# EAGLE design whypod (EAGLE 7.7.0)
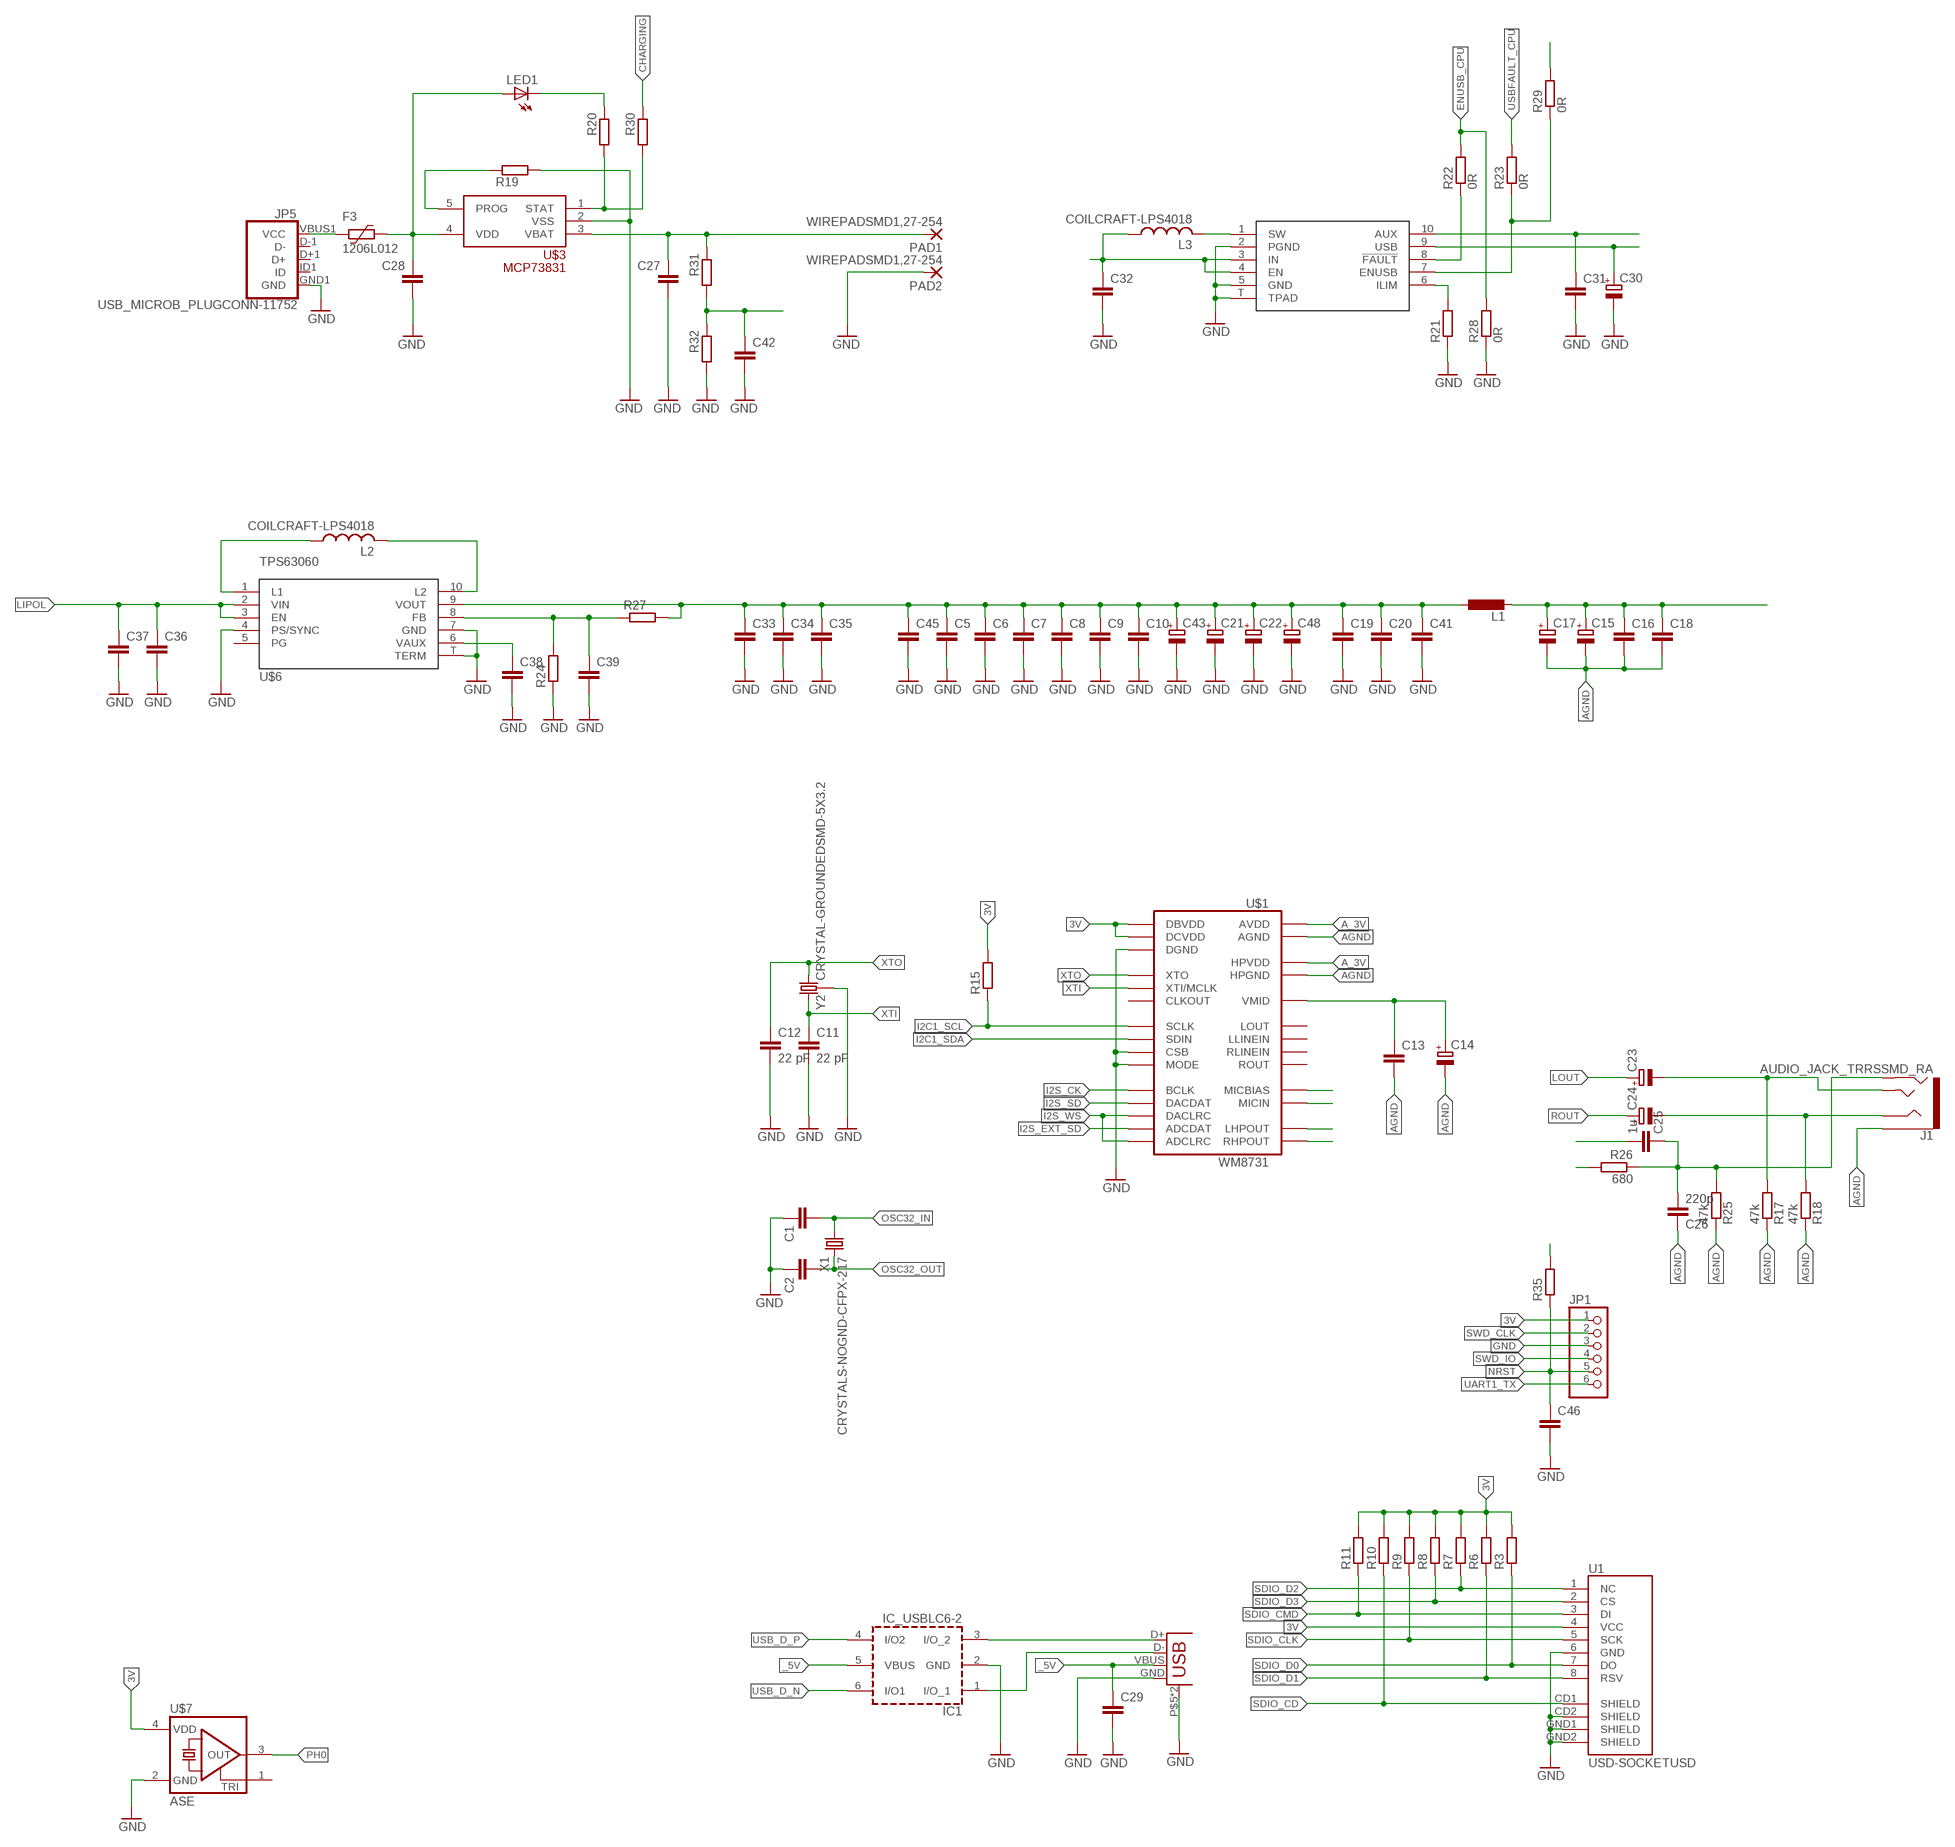
[diagram p0: schematic, sheet 1, part 1 of 2]
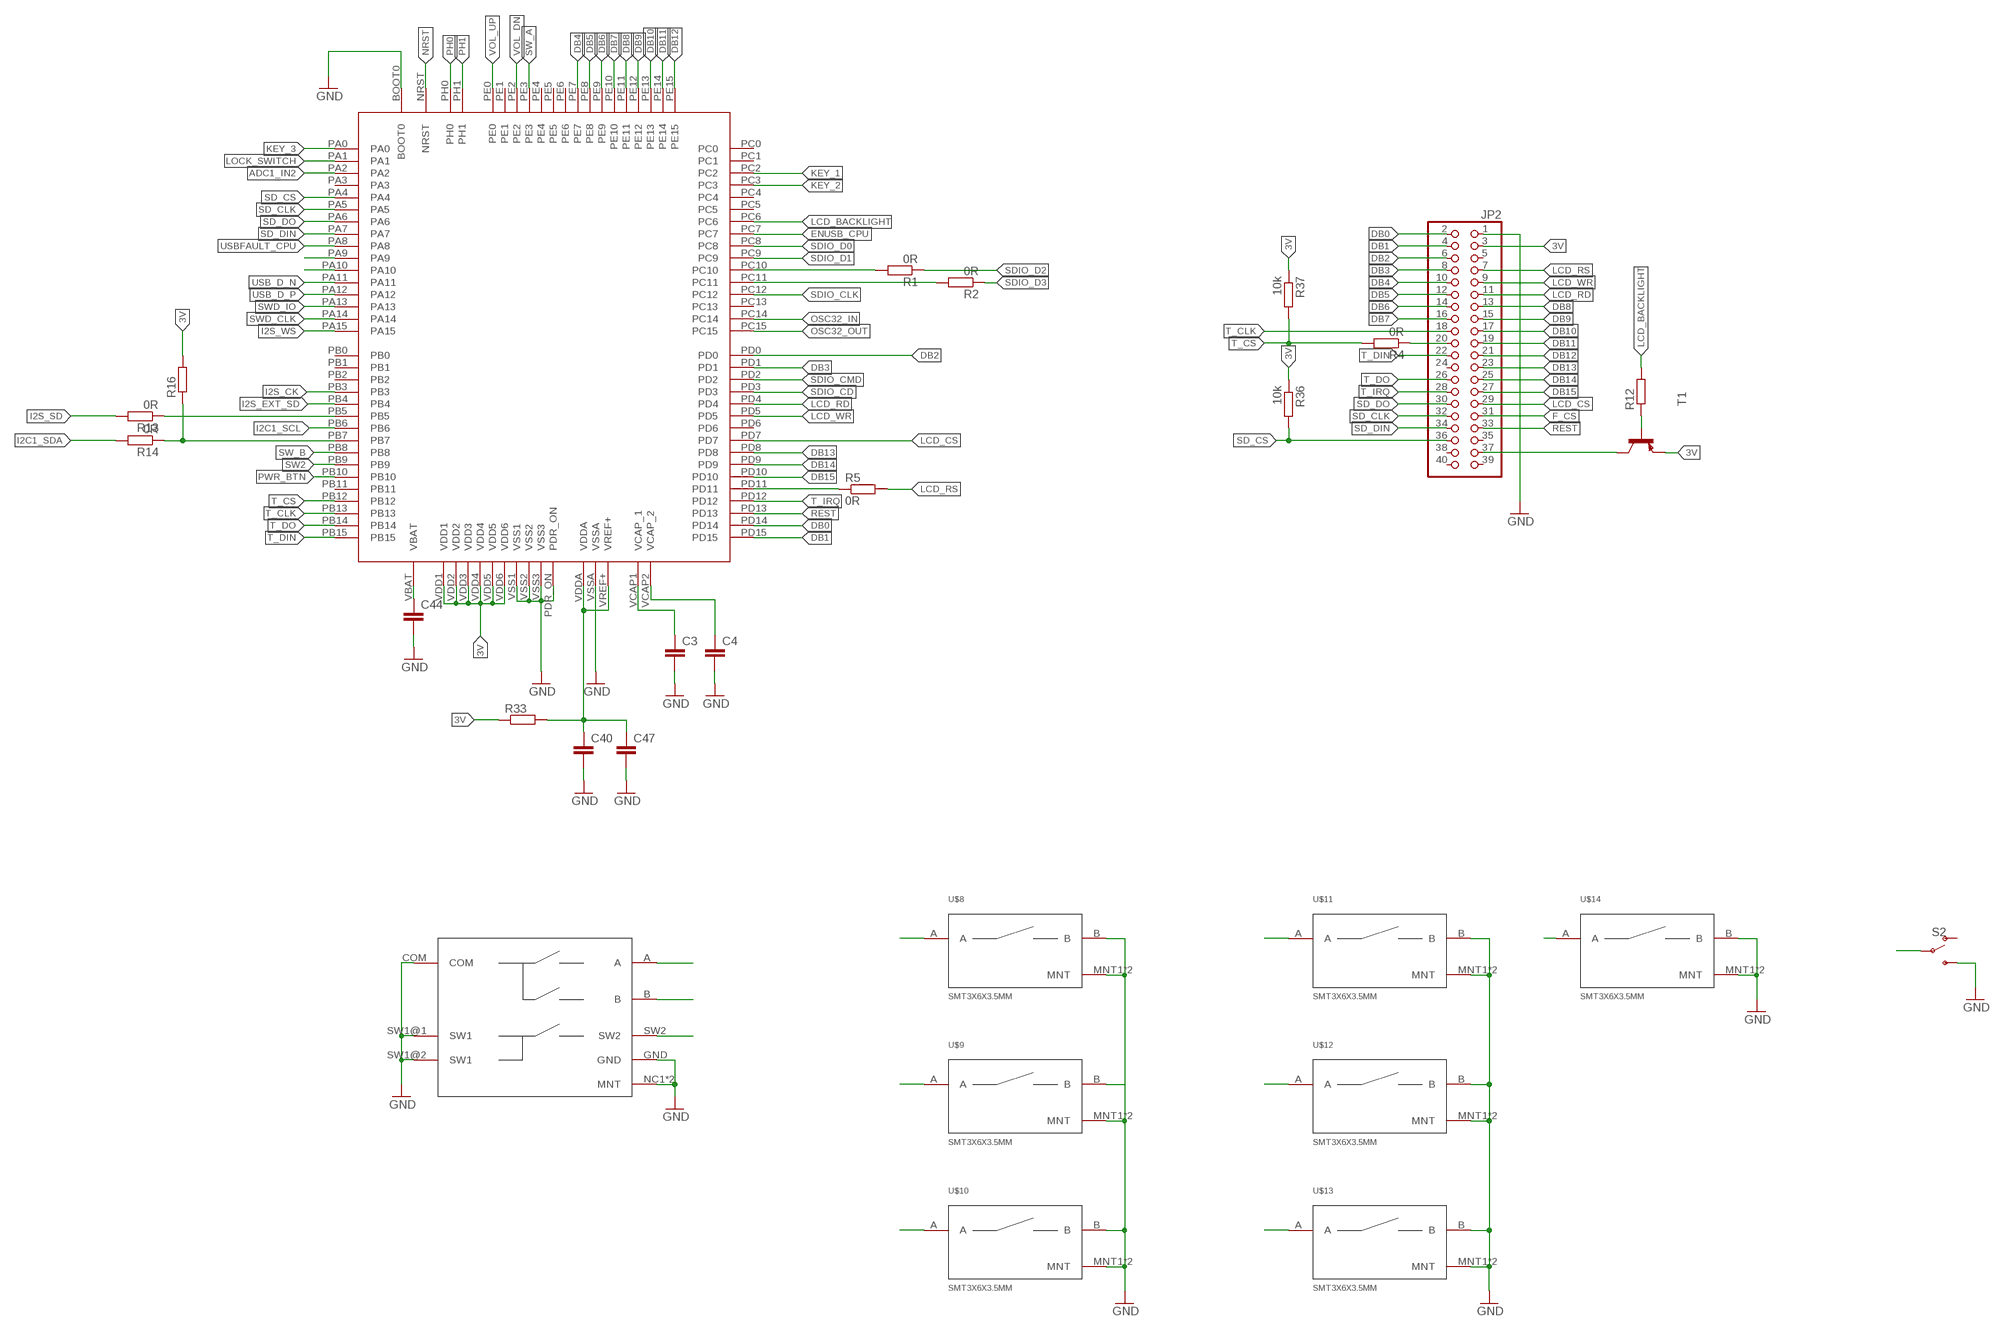
[diagram p1: schematic, sheet 1, part 2 of 2]

## Parts
C1  C-EUC0603  [C0603]
C2  C-EUC0603  [C0603]
C3  C-EUC0603  [C0603]
C4  C-EUC0603  [C0603]
C5  C-EUC0603  [C0603]
C6  C-EUC0603  [C0603]
C7  C-EUC0402  [C0402]
C8  C-EUC0603  [C0603]
C9  C-EUC0603  [C0603]
C10  C-EUC0603  [C0603]
C11  22 pF  C-EUC0603  [C0603]
C12  22 pF  C-EUC0603  [C0603]
C13  C-EUC0603  [C0603]
C14  CPOL-EUSMCA  [SMC_A]
C15  CPOL-EUSMCA  [SMC_A]
C16  C-EUC0603  [C0603]
C17  CPOL-EUSMCA  [SMC_A]
C18  C-EUC0603  [C0603]
C19  C-EUC0603  [C0603]
C20  C-EUC0603  [C0603]
C21  CPOL-EUSMCA  [SMC_A]
C22  CPOL-EUSMCA  [SMC_A]
C23  CPOL-EUSMCE  [SMC_E]
C24  CPOL-EUSMCE  [SMC_E]
C25  1u  C-EUC0603  [C0603]
C26  220p  C-EUC0603  [C0603]
C27  C-EUC0603  [C0603]
C28  C-EUC0603  [C0603]
C29  C-EUC0603  [C0603]
C30  CPOL-EUSMCD  [SMC_D]
C31  C-EUC0603  [C0603]
C32  C-EUC0603  [C0603]
C33  C-EUC0805  [C0805]
C34  C-EUC0805  [C0805]
C35  C-EUC0805  [C0805]
C36  C-EUC0805  [C0805]
C37  C-EUC0805  [C0805]
C38  C-EUC0603  [C0603]
C39  C-EUC0402  [C0402]
C40  C-EUC0402  [C0402]
C41  C-EUC0402  [C0402]
C42  C-EUC0603  [C0603]
C43  CPOL-EUSMCA  [SMC_A]
C44  C-EUC0402  [C0402]
C45  C-EUC0402  [C0402]
C46  C-EUC0603  [C0603]
C47  C-EUC0603  [C0603]
C48  CPOL-EUSMCA  [SMC_A]
F3  1206L012  [1206L]
IC1  IC_USBLC6-2  [SOT-23-6L]
J1  AUDIO_JACK_TRRSSMD_RA  [AUDIO_JACK_3.5MM_TRRS_SMD_RA]
JP1  PINHD-1X06_2.54-SMD-90°  [1X06SMD/90]
JP2  PINHD-2X20_2.54-SMD  [2X20SMD]
JP5  USB_MICROB_PLUGCONN-11752  [USB-B-MICRO-SMD_V03]
L1  L-EUL3225M  [L3225M]
L2  COILCRAFT-LPS4018  [LPS4018]
L3  COILCRAFT-LPS4018  [LPS4018]
LED1  LEDCHIP-LED0603  [CHIP-LED0603]
PAD1  WIREPADSMD1,27-254  [SMD1,27-2,54]
PAD2  WIREPADSMD1,27-254  [SMD1,27-2,54]
R1  0R  R-EU_R0603  [R0603]
R2  0R  R-EU_R0603  [R0603]
R3  R-EU_R0603  [R0603]
R4  0R  R-EU_R0603  [R0603]
R5  0R  R-EU_R0603  [R0603]
R6  R-EU_R0603  [R0603]
R7  R-EU_R0402  [R0402]
R8  R-EU_R0603  [R0603]
R9  R-EU_R0402  [R0402]
R10  R-EU_R0603  [R0603]
R11  R-EU_R0603  [R0603]
R12  R-EU_R0402  [R0402]
R13  0R  R-EU_R0603  [R0603]
R14  0R  R-EU_R0603  [R0603]
R15  R-EU_R0603  [R0603]
R16  R-EU_R0402  [R0402]
R17  47k  R-EU_R0603  [R0603]
R18  47k  R-EU_R0603  [R0603]
R19  R-EU_R0603  [R0603]
R20  R-EU_R0603  [R0603]
R21  R-EU_R0603  [R0603]
R22  0R  R-EU_R0603  [R0603]
R23  0R  R-EU_R0603  [R0603]
R24  R-EU_R0402  [R0402]
R25  47k  R-EU_R0603  [R0603]
R26  680  R-EU_R0603  [R0603]
R27  R-EU_R0402  [R0402]
R28  0R  R-EU_R0603  [R0603]
R29  0R  R-EU_R0603  [R0603]
R30  R-EU_R0603  [R0603]
R31  R-EU_R0603  [R0603]
R32  R-EU_R0603  [R0603]
R33  R-EU_M0805  [M0805]
R35  R-EU_R0603  [R0603]
R36  10k  R-EU_R0603  [R0603]
R37  10k  R-EU_R0603  [R0603]
S2  SWITCH-SPDT-SMD-RIGHT-ANGLE  [SWITCH_SPST_SMD_A]
T1  BC857A-PNP-SOT23-BEC  [SOT23-BEC]
U1  USD-SOCKETUSD  [USD-SOCKET-PP]
U$1  WM8731  [28-SSOP]
U$2  STM32F4V_100PIN_GENERIC  [LQFP100]
U$3  MCP73831SOT-23-5  [SOT-23-5]
U$4  EVQWKSMD  [EVQWK_SMD]
U$5  TPS2500  [DRC10]
U$6  TPS63060  [DRC10]
U$7  ASE  [ASE]
U$8  SMT3X6X3.5MM  [SMT3X6X3.5MM]
U$9  SMT3X6X3.5MM  [SMT3X6X3.5MM]
U$10  SMT3X6X3.5MM  [SMT3X6X3.5MM]
U$11  SMT3X6X3.5MM  [SMT3X6X3.5MM]
U$12  SMT3X6X3.5MM  [SMT3X6X3.5MM]
U$13  SMT3X6X3.5MM  [SMT3X6X3.5MM]
U$14  SMT3X6X3.5MM  [SMT3X6X3.5MM]
X1  CRYSTALS-NOGND-CFPX-217  [3.2X1.5-2-PAD]
X2  USB-A-S  [USB-A-S]
Y2  CRYSTAL-GROUNDEDSMD-5X3.2  [CRYSTAL-SMD-5X3.2-4PAD]

## Nets
3V: C5.1 C6.1 C7.1 C8.1 C9.1 C10.1 C19.1 C20.1 C21.+ C22.+ C33.1 C34.1 C35.1 C41.1 C43.+ C45.1 C48.+ JP1.1 JP2.3 L1.1 R3.2 R6.2 R7.2 R8.2 R9.2 R10.2 R11.2 R15.2 R16.2 R27.2 R29.2 R33.1 R35.2 R36.1 R37.1 T1.E U1.4(VCC) U$1.P$1(DBVDD) U$1.P$27(DCVDD) U$2.VDD1 U$2.VDD2 U$2.VDD3 U$2.VDD4 U$2.VDD5 U$2.VDD6 U$6.9(VOUT) U$7.4(VDD)
_5V: C29.1 C30.+ IC1.5(VBUS) U$5.9(USB) X2.VBUS
A_3V: C15.+ C16.1 C17.+ C18.1 L1.2 U$1.P$8(HPVDD) U$1.P$14(AVDD)
ADC1_IN2: C42.1 R31.2 R32.1 U$2.PA2
AGND: C13.2 C14.- C15.- C16.2 C17.- C18.2 C26.1 J1.EARTH R17.1 R18.1 R25.1 U$1.P$11(HPGND) U$1.P$15(AGND)
CHARGING: R30.1 U$2.PA10
DB0: JP2.2 U$2.PD14
DB1: JP2.4 U$2.PD15
DB2: JP2.6 U$2.PD0
DB3: JP2.8 U$2.PD1
DB4: JP2.10 U$2.PE7
DB5: JP2.12 U$2.PE8
DB6: JP2.14 U$2.PE9
DB7: JP2.16 U$2.PE10
DB8: JP2.13 U$2.PE11
DB9: JP2.15 U$2.PE12
DB10: JP2.17 U$2.PE13
DB11: JP2.19 U$2.PE14
DB12: JP2.21 U$2.PE15
DB13: JP2.23 U$2.PD8
DB14: JP2.25 U$2.PD9
DB15: JP2.27 U$2.PD10
ENUSB: R22.1 U$5.8(!FAULT)
ENUSB_CPU: R22.2 R28.2 U$2.PC7
F_CS: JP2.31
GND: C1.1 C2.1 C3.2 C4.2 C5.2 C6.2 C7.2 C8.2 C9.2 C10.2 C11.2 C12.2 C19.2 C20.2 C21.- C22.- C27.2 C28.2 C29.2 C30.- C31.2 C32.2 C33.2 C34.2 C35.2 C36.2 C37.2 C38.2 C39.2 C40.2 C41.2 C42.2 C43.- C44.2 C45.2 C46.2 C47.2 C48.- IC1.2(GND) JP1.3 JP2.1 JP5.GND1(GND) PAD2.1(P) R19.2 R21.1 R24.1 R28.1 R32.2 S2.3(S) U1.6(GND) U1.CD2(SHIELD) U1.GND1(SHIELD) U1.GND2(SHIELD) U$1.P$21(MODE) U$1.P$22(CSB) U$1.P$28(DGND) U$2.BOOT0 U$2.PDR_ON U$2.VSS1 U$2.VSS2 U$2.VSS3 U$2.VSSA U$3.2(VSS) U$4.COM U$4.GND U$4.NC1(MNT) U$4.NC2(MNT) U$4.SW1@1(SW1) U$4.SW1@2(SW1) U$5.2(PGND) U$5.5(GND) U$5.T(TPAD) U$6.4(PS/SYNC) U$6.7(GND) U$6.T(TERM) U$7.2(GND) U$8.B U$8.MNT1(MNT) U$8.MNT2(MNT) U$9.B U$9.MNT1(MNT) U$9.MNT2(MNT) U$10.B U$10.MNT1(MNT) U$10.MNT2(MNT) U$11.B U$11.MNT1(MNT) U$11.MNT2(MNT) U$12.B U$12.MNT1(MNT) U$12.MNT2(MNT) U$13.B U$13.MNT1(MNT) U$13.MNT2(MNT) U$14.B U$14.MNT1(MNT) U$14.MNT2(MNT) X2.GND X2.P$5(SHIELD) X2.P$6(SHIELD) Y2.2 Y2.4
I2C1_SCL: R15.1 U$1.P$24(SCLK) U$2.PB6
I2C1_SDA: R14.2 U$1.P$23(SDIN)
I2S_CK: U$1.P$3(BCLK) U$2.PB3
I2S_EXT_SD: U$1.P$6(ADCDAT) U$2.PB4
I2S_SD: R13.2 U$1.P$4(DACDAT)
I2S_WS: U$1.P$5(DACLRC) U$1.P$7(ADCLRC) U$2.PA15
KEY_1: U$2.PC2 U$11.A
KEY_2: U$2.PC3 U$12.A
KEY_3: U$2.PA0 U$13.A
LCD_BACKLIGHT: R12.2 U$2.PC6
LCD_CS: JP2.29 U$2.PD7
LCD_RD: JP2.11 U$2.PD4
LCD_RS: JP2.7 R5.2
LCD_WR: JP2.9 U$2.PD5
LED_A: JP2.37 T1.C
LIPOL: C27.1 C32.1 C36.1 C37.1 L3.1 PAD1.1(P) R31.1 U$3.3(VBAT) U$5.3(IN) U$5.4(EN) U$6.2(VIN) U$6.3(EN)
LOCK_SWITCH: S2.2(P) U$2.PA1
LOUT: C23.+ U$1.P$9(LHPOUT)
MICBIAS: R26.2 U$1.P$17(MICBIAS)
MICIN: C25.2 U$1.P$18(MICIN)
N$1: IC1.3(I/O_2) X2.D+
N$2: IC1.1(I/O_1) X2.D-
N$3: JP2.20 R4.1
N$4: R5.1 U$2.PD11
N$5: R1.2 U$2.PC10
N$6: C3.1 U$2.VCAP1(VCAP_1)
N$7: C4.1 U$2.VCAP2(VCAP_2)
N$8: R2.2 U$2.PC11
N$11: R12.1 T1.B
N$12: C13.1 C14.+ U$1.P$16(VMID)
N$13: C23.- J1.TIP R17.2
N$14: R13.1 U$2.PB5
N$15: C24.- J1.RING1 R18.2
N$16: R14.1 R16.1 U$2.PB7
N$17: R19.1 U$3.5(PROG)
N$18: R20.2 R30.2 U$3.1(STAT)
N$19: LED1.C R20.1
N$20: F3.2 JP5.VBUS1(VCC)
N$21: R21.2 U$5.6(ILIM)
N$22: C31.1 U$5.10(AUX)
N$23: C38.1 U$6.6(VAUX)
N$24: L3.2 U$5.1(SW)
N$25: C39.1 R24.2 R27.1 U$6.8(FB)
N$26: L2.2 U$6.10(L2)
N$27: L2.1 U$6.1(L1)
N$28: C40.1 C47.1 R33.2 U$2.VDDA U$2.VREF+
N$30: C44.1 U$2.VBAT
N$55: C25.1 C26.2 J1.RING2 R25.2 R26.1
NRST: C46.1 JP1.5 R35.1 U$2.NRST U$14.A
OSC32_IN: C1.2 U$2.PC14 X1.1
OSC32_OUT: C2.2 U$2.PC15 X1.2
PH0: U$2.PH0 U$7.3(OUT)
PH1: U$2.PH1
PWR_BTN: U$2.PB10 U$8.A
REST: JP2.33 U$2.PD13
ROUT: C24.+ U$1.P$10(RHPOUT)
SD_CLK: JP2.32 U$2.PA5
SD_CS: JP2.36 R36.2 U$2.PA4
SD_DIN: JP2.34 U$2.PA7
SD_DO: JP2.30 U$2.PA6
SDIO_CD: R10.1 U1.CD1(SHIELD) U$2.PD3
SDIO_CLK: R9.1 U1.5(SCK) U$2.PC12
SDIO_CMD: R11.1 U1.3(DI) U$2.PD2
SDIO_D0: R3.1 U1.7(DO) U$2.PC8
SDIO_D1: R6.1 U1.8(RSV) U$2.PC9
SDIO_D2: R1.1 R7.1 U1.1(NC)
SDIO_D3: R2.1 R8.1 U1.2(CS)
SW2: U$2.PB9 U$4.SW2
SW_A: U$2.PE3 U$4.A
SW_B: U$2.PB8 U$4.B
SWD_CLK: JP1.2 U$2.PA14
SWD_IO: JP1.4 U$2.PA13
T_CLK: JP2.18 U$2.PB13
T_CS: R4.2 R37.2 U$2.PB12
T_DIN: JP2.22 U$2.PB15
T_DO: JP2.26 U$2.PB14
T_IRQ: JP2.28 U$2.PD12
UART1_TX: JP1.6 U$2.PA9
USB_D_N: IC1.6(I/O1) U$2.PA11
USB_D_P: IC1.4(I/O2) U$2.PA12
USBFAULT: R23.1 R29.1 U$5.7(ENUSB)
USBFAULT_CPU: R23.2 U$2.PA8
VBUS: C28.1 F3.1 LED1.A U$3.4(VDD)
VOL_DN: U$2.PE2 U$10.A
VOL_UP: U$2.PE0 U$9.A
XTI: C11.1 U$1.P$25(XTI/MCLK) Y2.3
XTO: C12.1 U$1.P$26(XTO) Y2.1
Unconnected: JP2.5 JP2.24 JP2.35 JP2.38 JP2.39 JP2.40 JP5.D+1(D+) JP5.D-1(D-) JP5.ID1(ID) S2.1(O) U$1.P$2(CLKOUT) U$1.P$12(LOUT) U$1.P$13(ROUT) U$1.P$19(RLINEIN) U$1.P$20(LLINEIN) U$2.PA3 U$2.PB0 U$2.PB1 U$2.PB2 U$2.PB11 U$2.PC0 U$2.PC1 U$2.PC4 U$2.PC5 U$2.PC13 U$2.PD6 U$2.PE1 U$2.PE4 U$2.PE5 U$2.PE6 U$6.5(PG) U$7.1(TRI)

## Library data of the parts
C1-C13 C16 C18-C20 C25-C29 C31-C42 C44-C47 = rcl:C-EU: CAPACITOR, European symbol
C14 C15 C17 C21-C24 C30 C43 C48 = rcl:CPOL-EU: POLARIZED CAPACITOR, European symbol
F3 = polyfuse-smd_10:?: Polyfuse Resettable PTC Source: http://www.littelfuse.com/products/resettable-ptcs.aspx; MF: Littelfuse; MPN: 1206L012; OC_FARNELL: 1596988; OC_NEWARK: 05M2298
IC1 = dp_devices:IC_USBLC6-2
J1 = SparkFun-Connectors:AUDIO_JACK_TRRS: Audio Jack - 3.5mm TRRS (SMD) This is a 3.5mm TRRS SMD audio jack. TRRS connectors are the audio-style connectors that you see on some phones, MP3 players and development boards. TRRS stands for “tip, ring, ring, sleeve,” which reflects that this has three conductors and a ground. SparkFun Products: Audio Jack <https://www.sparkfun.com/products/12639> mbed Starter Kit <https://www.sparkfun.com/products/12968> SparkFun TRRS 3.5mm Jack Breakout <https://www.sparkfun.com/products/11570>; PROD_ID: CONN-10676; SF_ID: PRT-12639
JP1 = pinhead-2:PINHD-1X06: PIN HEADER
JP2 = pinhead-2:PINHD-2X20: PIN HEADER
JP5 = SparkFun-Connectors:USB_MICROB_PLUG: USB Micro-B connectors Some male, some female. Watch your step!; PROD_ID: CONN-11752
L1 = rcl:L-EU: INDUCTOR, European symbol
L2 L3 = passives:COILCRAFT-LPS4018: Coilcraft Shielded SMT Power Inductors – LPS4018 Series
LED1 = led:LED: LED OSRAM: - CHIPLED LG R971, LG N971, LY N971, LG Q971, LY Q971, LO R971, LY R971 LH N974, LH R974 LS Q976, LO Q976, LY Q976 LO Q996 - Hyper CHIPLED LW Q18S LB Q993, LB Q99A, LB R99A - SideLED LS A670, LO A670, LY A670, LG A670, LP A670 LB A673, LV A673, LT A673, LW A673 LH A674 LY A675 LS A676, LA A676, LO A676, LY A676, LW A676 LS A679, LY A679, LG A679 - Hyper Micro SIDELED® LS Y876, LA Y876, LO Y876, LY Y876 LT Y87S - SmartLED LW L88C, LW L88S LB L89C, LB L89S, LG L890 LS L89K, LO L89K, LY L89K LS L896, LA L896, LO L896, LY L896 - TOPLED LS T670, LO T670, LY T670, LG T670, LP T670 LSG T670, LSP T670, LSY T670, LOP T670, LYG T670 LG T671, LOG T671, LSG T671 LB T673, LV T673, LT T673, LW T673 LH T674 LS T676, LA T676, LO T676, LY T676, LB T676, LH T676, LSB T676, LW T676 LB T67C, LV T67C, LT T67C, LS T67K, LO T67K, LY T67K, LW E67C LS E67B, LA E67B, LO E67B, LY E67B, LB E67C, LV E67C, LT E67C LW T67C LS T679, LY T679, LG T679 LS T770, LO T770, LY T770, LG T770, LP T770 LB T773, LV T773, LT T773, LW T773 LH T774 LS E675, LA E675, LY E675, LS T675 LS T776, LA T776, LO T776, LY T776, LB T776 LHGB T686 LT T68C, LB T68C - Hyper Mini TOPLED® LB M676 - Mini TOPLED Santana® LG M470 LS M47K, LO M47K, LY M47K Source: http://www.osram.convergy.de LUXEON: - LUMILED® LXK2-PW12-R00, LXK2-PW12-S00, LXK2-PW14-U00, LXK2-PW14-V00 LXK2-PM12-R00, LXK2-PM12-S00, LXK2-PM14-U00 LXK2-PE12-Q00, LXK2-PE12-R00, LXK2-PE12-S00, LXK2-PE14-T00, LXK2-PE14-U00 LXK2-PB12-K00, LXK2-PB12-L00, LXK2-PB12-M00, LXK2-PB14-N00, LXK2-PB14-P00, LXK2-PB14-Q00 LXK2-PR12-L00, LXK2-PR12-M00, LXK2-PR14-Q00, LXK2-PR14-R00 LXK2-PD12-Q00, LXK2-PD12-R00, LXK2-PD12-S00 LXK2-PH12-R00, LXK2-PH12-S00 LXK2-PL12-P00, LXK2-PL12-Q00, LXK2-PL12-R00 Source: www.luxeon.com KINGBRIGHT: KA-3528ASYC Source: www.kingbright.com
PAD1 PAD2 = wirepad:WIREPAD: Wire PAD connect wire on PCB
R1-R33 R35-R37 = rcl:R-EU_: RESISTOR, European symbol
S2 = SparkFun-Switches:SWITCH-SPDT: Single Pole, Double Throw (SPDT) Switch Single-pole, double-throw (SPDT) switch. Variant Overview SMD-AYZ0202 Surface Mount DPDT Switch <https://www.sparkfun.com/products/597> (COM-00597) Used on e.g. LilyPad Arduino USB - ATmega32U4 Board <https://www.sparkfun.com/products/12049> PTH-11.6X4.0MM SPDT Mini Power Switch <https://www.sparkfun.com/products/102> (COM-00102) Used on e.g. SparkFun Simon Says - Through-Hole Soldering Kit <https://www.sparkfun.com/products/10547> (KIT-10547) PTH-11.6X4.0MM-KIT KIT version of SPDT Mini Power Switch - Simplifies soldering by removing tStop of switch pins - only one side can be soldered. PTH-11.6X4.0MM-LOCK LOCK version of SPDT Mini Power Switch - Offset pins hold switch in place for easier soldering. SMD-RIGHT-ANGLE Surface Mount Right Angle Switch <https://www.sparkfun.com/products/10860> (COM-10860) Used on e.g. SparkFun ESP8266 Thing <https://www.sparkfun.com/products/13231>; PROD_ID: SWCH-10651; SF_SKU: COM-10860
T1 = transistor:*-PNP-: PNP Transistror
U1 = SparkFun-Connectors:USD-SOCKET: microSD Socket Push-push type uSD socket. Schematic element and footprint production proven. Spark Fun Electronics SKU : PRT-00127. tDoc lines correctly indicate media card edge positions when inserting (unlocked, locked, depressed).
U$1 = microdecv1:WM8731
U$2 = stm32f4:STM32F4V_100PIN_GENERIC
U$3 = lion-charger:MCP73831
U$4 = mw:EVQWK
U$5 = mw:TPS2500
U$6 = mw:TPS63060
U$7 = crystal:ASE: 3.3Vdc CMOS SMD CRYSTAL CLOCK OSCILLATOR SOurce: www.abracon.com; OC_FARNELL: unknown; OC_NEWARK: unknown
U$8-U$14 = mw:SMT3X6X3.5MM
X1 = IQD-Frequency-Products:CRYSTALS-NOGND: CRYSTALS CAN NOT GROUNDED
X2 = con-usb:USB: USB Connectors
Y2 = SparkFun-Clocks:CRYSTAL-GROUNDED: Crystals w/ Ground Pin (Generic) These are passive quartz crystals, which can be used as a clock source for a microcontroller. Crystal's are usually two-terminal devices. A third terminal may be optionally connected to ground, as recommended by the manufaturer.

## Board
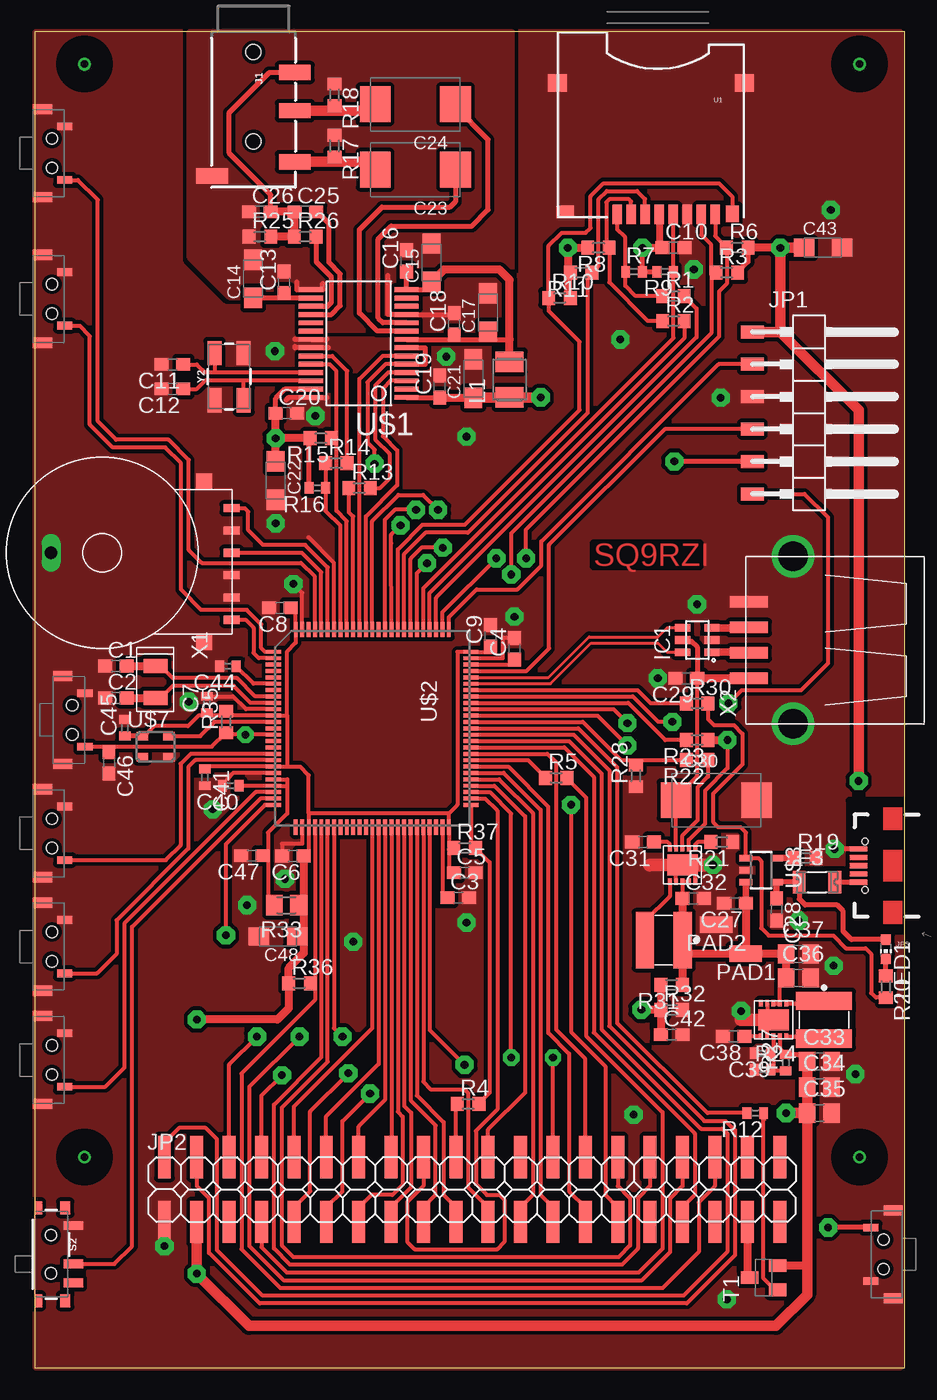
[diagram p2: board, top side]
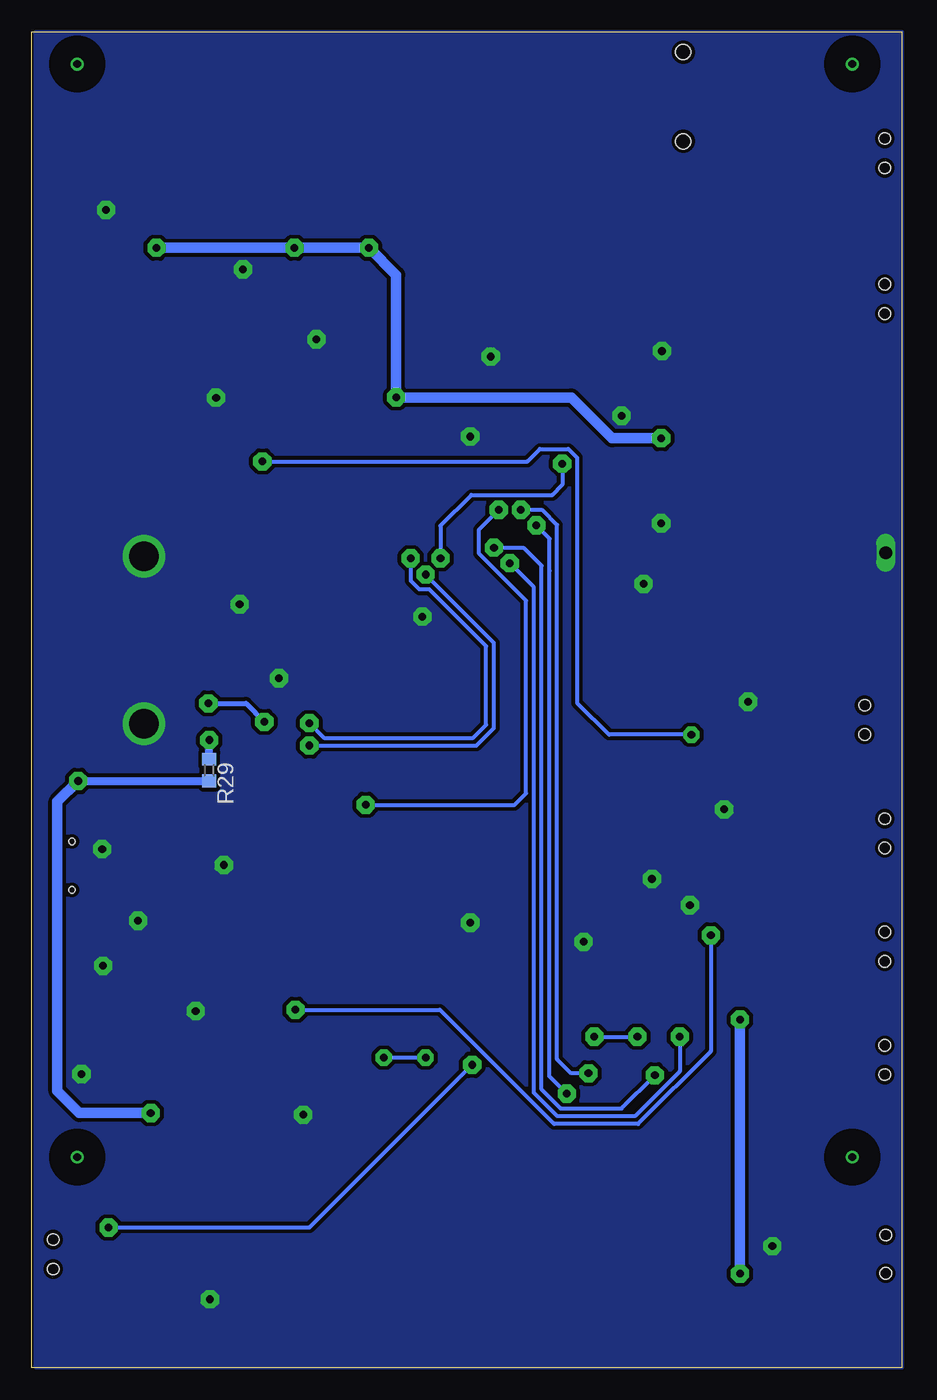
[diagram p3: board, bottom side, seen from below]

Size 68.25 x 104.77 mm. Coordinates in mm from the lower left corner, seen from the top.
Outline: 0,0 68.25,0 68.25,104.77 0,104.77 0,0
Copper layers (1*16): Top 0.035mm / dielectric 1.5mm / Bottom 0.035mm
Design rules "default *": minimum track width 10mil, minimum drill 24mil, track to track 8mil, track to pad 8mil, pad to pad 8mil, via to via 8mil, smd to smd 8mil, copper to edge 0mil, drill to drill 8mil, minimum pad ring 10mil, minimum via ring 8mil, stop-mask expansion 4mil, vias tented up to drill 0mil, thermal gap 10mil
tRestrict: area 2.1,14.7 to 5.7,18.3; area 62.9,14.7 to 66.5,18.3; area 63.9,34.3 to 67.9,44.5; area 49.7,37.8 to 51.9,41; area 60.3,36.8 to 63.6,39; area 56.8,25.7 to 59.1,28.8; area 59.7,26 to 64.1,28.6; area 48.3,31.3 to 50.3,35.7; area 62.9,100.5 to 66.5,104; area 2.1,100.5 to 5.7,104; area 22.9,57.3 to 24.1,57.8
bRestrict: area 2.1,100.5 to 5.7,104; area 62.9,100.5 to 66.5,104; area 2.1,14.7 to 5.7,18.3; area 62.9,14.7 to 66.5,18.3

### Footprints (pad centres in the part's own frame; a part is rotated, then mirrored left to right if it is on the bottom)
C0603 = smd 1.1 x 1: 1 -0.85,0; 2 0.85,0
C0402 = smd 0.7 x 0.9: 1 -0.65,0; 2 0.65,0
SMC_A = smd 1.6 x 1.4: + -1.5,0; - 1.5,0
SMC_E = smd 2.4 x 2.8: + -3.15,0; - 3.15,0
SMC_D = smd 2.4 x 2.8: + -3.15,0; - 3.15,0
C0805 = smd 1.3 x 1.5: 1 -0.95,0; 2 0.95,0
1206L = smd 1 x 1.8: 1 -1.4,0; 2 1.4,0
SOT-23-6L = smd 0.6 x 1.2: 1 -0.95,-2.3; 2 0,-2.3; 3 0.95,-2.3; 4 0.95,0; 5 0,0; 6 -0.95,0
AUDIO_JACK_3.5MM_TRRS_SMD_RA = smd 1.2 x 2.5: EARTH 11.3,-3.25; RING1 6.2,3.25; RING2 3.2,3.25; TIP 10.2,3.25 | hole 1.2: 1.6,0; 8.6,0
1X06SMD/90 = smd 1.016 x 1.778: 1 -1.27,-5.08; 2 1.27,-5.08; 3 3.81,-5.08; 4 6.35,-5.08; 5 8.89,-5.08; 6 11.43,-5.08
2X20SMD = smd 1.016 x 3.302: 1 -1.27,-3.81; 2 -1.27,1.27; 3 1.27,-3.81; 4 1.27,1.27; 5 3.81,-3.81; 6 3.81,1.27; 7 6.35,-3.81; 8 6.35,1.27; 9 8.89,-3.81; 10 8.89,1.27; 11 11.43,-3.81; 12 11.43,1.27; 13 13.97,-3.81; 14 13.97,1.27; 15 16.51,-3.81; 16 16.51,1.27; 17 19.05,-3.81; 18 19.05,1.27; 19 21.59,-3.81; 20 21.59,1.27; 21 24.13,-3.81; 22 24.13,1.27; 23 26.67,-3.81; 24 26.67,1.27; 25 29.21,-3.81; 26 29.21,1.27; 27 31.75,-3.81; 28 31.75,1.27; 29 34.29,-3.81; 30 34.29,1.27; 31 36.83,-3.81; 32 36.83,1.27; 33 39.37,-3.81; 34 39.37,1.27; 35 41.91,-3.81; 36 41.91,1.27; 37 44.45,-3.81; 38 44.45,1.27; 39 46.99,-3.81; 40 46.99,1.27
USB-B-MICRO-SMD_V03 = smd 1.4 x 0.4: D+1 2.7,0; D-1 2.7,0.65; GND1 2.7,-1.3; ID1 2.7,-0.65; VBUS1 2.7,1.3 | hole 0.5: 2.2,1.9; 2.2,-1.9
L3225M = smd 1.6 x 2.2: 1 -1.4,0; 2 1.4,0
LPS4018 = smd 1.435 x 4.394: 1 -1.48,0; 2 1.48,0
CHIP-LED0603 = smd 0.8 x 0.8: A 0,-0.75; C 0,0.75
SMD1,27-2,54 = smd 1.27 x 2.54: 1 0,0
R0603 = smd 1 x 1.1: 1 -0.85,0; 2 0.85,0
R0402 = smd 0.7 x 0.9: 1 -0.65,0; 2 0.65,0
M0805 = smd 1.3 x 1.6: 1 -0.95,0; 2 0.95,0
SWITCH_SPST_SMD_A = smd 0.7 x 1.5: 1 -2.25,-1.75; 2 -0.75,-1.75; 3 2.25,-1.75 | smd 1 x 0.6: GND1 -3.65,1; GND3 3.65,1 | smd 1 x 0.8: GND2 -3.65,-1.1; GND4 3.65,-1.1 | hole 0.9: -1.5,0; 1.5,0
SOT23-BEC = smd 1 x 1.4: B -0.95,-1.1; C 0,1.1; E 0.95,-1.1
USD-SOCKET-PP = smd 0.75 x 1.5: 1 3.2,14.3; 2 2.1,14.3; 3 1,14.3; 4 -0.1,14.3; 5 -1.2,14.3; 6 -2.3,14.3; 7 -3.4,14.3; 8 -4.5,14.3 | smd 1 x 1.3: CD1 -5.85,14.25 | smd 1.4 x 1: CD2 7.275,14.1 | smd 1.5 x 1.35: GND1 -6.775,4; GND2 7.875,4
28-SSOP = smd 0.381 x 1.905: P$1 -4.55,-3.752; P$2 -3.9,-3.752; P$3 -3.25,-3.752; P$4 -2.6,-3.752; P$5 -1.95,-3.752; P$6 -1.3,-3.752; P$7 -0.65,-3.752; P$8 0,-3.752; P$9 0.65,-3.752; P$10 1.3,-3.752; P$11 1.95,-3.752; P$12 2.6,-3.752; P$13 3.25,-3.752; P$14 3.9,-3.752; P$15 3.9,3.752; P$16 3.25,3.752; P$17 2.6,3.752; P$18 1.95,3.752; P$19 1.3,3.752; P$20 0.65,3.752; P$21 0,3.752; P$22 -0.65,3.752; P$23 -1.3,3.752; P$24 -1.95,3.752; P$25 -2.6,3.752; P$26 -3.25,3.752; P$27 -3.9,3.752; P$28 -4.55,3.752
LQFP100 = smd 1.2 x 0.3: BOOT0 -7.75,-3; PA3 7.75,-6.016; PA4 7.75,-4.5; PA5 7.75,-4; PA6 7.75,-3.5; PA7 7.75,-3; PA14 -7.75,6; PA15 -7.75,5.5; PB0 7.75,-1.5; PB1 7.75,-1; PB2 7.75,-0.5; PB3 -7.75,-0.5; PB4 -7.75,-1; PB5 -7.75,-1.5; PB6 -7.75,-2; PB7 -7.75,-2.5; PB8 -7.75,-3.5; PB9 -7.75,-4; PB10 7.75,4.5; PB11 7.75,5; PC4 7.75,-2.5; PC5 7.75,-2; PC10 -7.75,5; PC11 -7.75,4.5; PC12 -7.75,4; PD0 -7.75,3.5; PD1 -7.75,3; PD2 -7.75,2.5; PD3 -7.75,2; PD4 -7.75,1.5; PD5 -7.75,1; PD6 -7.75,0.5; PD7 -7.75,0; PDR_ON -7.75,-5.5; PE0 -7.75,-4.5; PE1 -7.75,-5; PE7 7.75,0; PE8 7.75,0.5; PE9 7.75,1; PE10 7.75,1.5; PE11 7.75,2; PE12 7.75,2.5; PE13 7.75,3; PE14 7.75,3.5; PE15 7.75,4; VCAP1 7.75,5.5; VDD3 7.75,-4.984; VDD4 7.75,6; VDD6 -7.75,-6; VSS2 7.75,-5.5 | smd 0.3 x 1.2: NRST 0.5,-7.75; PA0 5,-7.75; PA1 5.5,-7.75; PA2 6,-7.75; PA8 -2,7.75; PA9 -2.5,7.75; PA10 -3,7.75; PA11 -3.5,7.75; PA12 -4,7.75; PA13 -4.5,7.75; PB12 6,7.75; PB13 5.5,7.75; PB14 5,7.75; PB15 4.5,7.75; PC0 1,-7.75; PC1 1.5,-7.75; PC2 2,-7.75; PC3 2.5,-7.75; PC6 0,7.75; PC7 -0.5,7.75; PC8 -1,7.75; PC9 -1.5,7.75; PC13 -3,-7.75; PC14 -2.5,-7.75; PC15 -2,-7.75; PD8 4,7.75; PD9 3.5,7.75; PD10 3,7.75; PD11 2.5,7.75; PD12 2,7.75; PD13 1.5,7.75; PD14 1,7.75; PD15 0.5,7.75; PE2 -6,-7.75; PE3 -5.5,-7.75; PE4 -5,-7.75; PE5 -4.5,-7.75; PE6 -4,-7.75; PH0 -0.5,-7.75; PH1 0,-7.75; VBAT -3.5,-7.75; VCAP2 -5,7.75; VDD1 -1,-7.75; VDD2 3,-7.75; VDD5 -6,7.75; VDDA 4.5,-7.75; VREF+ 4,-7.75; VSS1 -1.5,-7.75; VSS3 -5.5,7.75; VSSA 3.5,-7.75
SOT-23-5 = smd 0.5 x 1: 1 -0.95,-1.2; 2 0,-1.2; 3 0.95,-1.2; 4 0.95,1.2; 5 -0.95,1.2
EVQWK_SMD = smd 1.27 x 0.635: A 10.16,-5.25; B 10.16,3.5; COM 10.16,-3.5; SW1@1 10.16,-1.75; SW1@2 10.16,1.75; SW2 10.16,0 | drill 1 long: GND -4,0 | smd 1.27 x 1.27: NC1 8,-6.98; NC2 8,5.585
DRC10 = smd 0.5 x 0.3: 1 -1.3,1; 2 -1.3,0.5; 3 -1.3,0; 4 -1.3,-0.5; 5 -1.3,-1; 6 1.3,-1; 7 1.3,-0.5; 8 1.3,0; 9 1.3,0.5; 10 1.3,1 | smd 1.65 x 2.4: T 0,0
ASE = smd 0.9 x 0.65: 1 -1.05,-0.825; 2 1.05,-0.825; 3 1.05,0.825; 4 -1.05,0.825
SMT3X6X3.5MM = smd 0.6 x 1.2: A -2.1,-1; B 2.1,-1 | smd 0.8 x 1.5: MNT1 -3.45,0.75; MNT2 3.45,0.75 | hole 0.9: 1.15,0; -1.15,0
3.2X1.5-2-PAD = smd 1.1 x 1.9: 1 -1.25,0; 2 1.25,0
USB-A-S = smd 3 x 0.9: D+ 3.45,-1; D- 3.45,1; GND 3.45,-3; VBUS 3.45,3 | drill 2.311: P$5 0,-6.566; P$6 0,6.566
CRYSTAL-SMD-5X3.2-4PAD = smd 1.9 x 1.1: 1 -1.85,-1.15; 2 1.85,-1.15; 3 1.85,1.15; 4 -1.85,1.15

### Placement (x,y rotation side)
C1  6.35,55.02 0 top
C2  6.35,52.52 0 top
C3  33.21,36.85 0 top
C4  37.62,56.39 90 top
C5  33.71,38.81 0 top
C6  20.23,40.13 180 top
C7  13.49,52.01 90 top
C8  19.22,59.59 180 top
C9  35.74,57.39 90 top
C10  50.09,87.83 0 top
C11  10.79,78.68 180 top
C12  10.79,76.76 180 top
C13  19.56,85.11 90 top
C14  17.12,85.39 90 top
C15  31.11,86.65 90 top
C16  29.15,86.8 90 top
C17  35.53,82.76 90 top
C18  32.89,81.86 90 top
C19  31.75,76.94 90 top
C20  19.74,74.85 0 top
C21  34.39,77.57 90 top
C22  18.89,69.57 270 top
C23  29.84,93.95 180 top
C24  29.84,99.09 180 top
C25  21.21,90.65 0 top
C26  17.65,90.65 0 top
C27  54.91,36.42 180 top
C28  58.17,35.94 270 top
C29  51.1,54.06 180 top
C30  53.45,44.5 0 top
C31  47.7,41.22 180 top
C32  51.64,36.8 0 top
C33  61.54,24.03 0 top
C34  61.54,22 0 top
C35  61.54,19.97 0 top
C36  59.89,30.56 0 top
C37  59.89,32.46 0 top
C38  54.81,25.98 180 top
C39  57.09,24.66 180 top
C40  15.36,45.64 180 top
C41  13.34,46.29 270 top
C42  49.95,26.11 0 top
C43  61.82,87.83 0 top
C44  15.14,55.02 180 top
C45  7.06,50.17 90 top
C46  5.82,47.45 270 top
C47  17.02,40.16 180 top
C48  19.08,33.83 180 top
F3  61.35,38.07 0 top
IC1  50.8,57.06 90 top
J1  17.14,104.78 270 top
JP1  61.37,79.96 270 top
JP2  11.43,15.24 0 top
JP5  67.31,39.37 180 top
L1  37.24,77.5 90 top
L2  61.9,27.28 270 top
L3  49.33,33.53 180 top
LED1  66.75,32.82 180 top
PAD1  55.76,32.46 90 top
PAD2  53.44,34.75 90 top
R1  50.09,84.05 0 top
R2  50.09,82.09 0 top
R3  54.28,85.88 0 top
R4  33.99,20.68 0 top
R5  40.89,46.25 0 top
R6  55.09,87.83 0 top
R7  46.99,85.95 0 top
R8  44.21,87.83 180 top
R9  49.43,85.95 180 top
R10  41.15,83.9 0 top
R11  42.85,85.88 180 top
R12  56.52,19.96 180 top
R13  25.47,68.99 0 top
R14  23.65,70.94 0 top
R15  22.43,72.9 180 top
R16  22.15,68.99 180 top
R17  23.5,95.81 270 top
R18  23.5,99.82 270 top
R19  60.43,39.96 0 top
R20  66.75,29.87 270 top
R21  53.89,41.22 180 top
R22  51.95,47.65 180 top
R23  51.95,49.23 180 top
R24  57.09,23.37 0 top
R25  17.65,88.7 0 top
R26  21.21,88.7 0 top
R27  58.9,23.93 90 top
R28  47.14,46.41 90 top
R29  54.33,46.86 270 bottom
R30  51.95,52.1 0 top
R31  49.95,30.02 180 top
R32  49.95,28.07 0 top
R33  19.74,36.27 180 top
R35  15.01,50.64 90 top
R36  20.75,30.15 0 top
R37  33.71,40.77 0 top
S2  1.27,8.89 90 top
T1  57.16,7.06 90 top
U1  48.87,104.75 180 top
U$1  25.4,80.64 90 top
U$2  26.47,50.14 270 top
U$3  56.97,39.01 270 top
U$4  5.27,63.91 0 top
U$5  50.8,39.42 90 top
U$6  57.94,27.28 270 top
U$7  9.47,48.7 0 top
U$8  66.57,8.89 270 top
U$9  1.35,95.25 90 top
U$10  1.35,83.82 90 top
U$11  1.35,41.91 90 top
U$12  1.35,33.02 90 top
U$13  1.35,24.13 90 top
U$14  2.92,50.8 90 top
X1  9.47,53.77 270 top
X2  59.46,57.06 180 top
Y2  15.24,77.72 90 top

### Tracks (layer width: path | path; a pad name or v marks a point on that pad's centre or on a via)
3V  (via drill 0.6 pad 1.42)
  Top 0.305: 32.47,40.64 U$2.VDD4 32.47,43.46 | 32.47,40.64 32.47,39.21 C5.1 | C6.1 21.48,40.53 U$2.VDD3 21.48,43.46 | 32.47,43.46 21.48,43.46 | 19.79,47.14 U$2.VDD2 13.53,47.14 C41.1 | 19.79,51.14 U$2.VDD1 15.24,51.14 | 19.79,51.14 19.79,47.14 | 19.79,51.14 19.79,56.19 20.47,56.87 U$2.VDD6 20.47,59.19 C8.1 | 32.47,43.46 33.15,44.14 33.15,56.14 U$2.VDD5 35.34,56.14 C9.1 | U$6.9 58.44,25.04 R27.2 | 21.48,43.46 21.48,46.46 20.8,47.14 19.79,47.14 | R33.1 20.76,36.2 21.08,36.2 | 15.24,51.14 13.34,51.14 | R35.2 15.01,51.37 15.24,51.14 | C7.1 13.49,51.29 13.34,51.14 | 13.34,51.14 12.84,51.14 12.01,50.32 9.35,50.32 8.55,49.52 U$7.4 | R37.1 32.59,40.77 32.47,40.64
  Top 0.381: U$1.P$1 C19.1 | 34.37,76.09 C21.+ | 37.21,76.07 L1.1 | U$1.P$27 19.59,76.75 18.89,76.04 C20.1
  Top 0.406: 48.97,88.09 48.98,88.09 C10.1 | 43.34,87.82 R8.2 | R9.2 R7.2 v47.64,87.82 v47.65,87.83 | R16.2 21.5,72.82 R15.2 | 60.62,24.02 C33.1 60.04,24.58 R27.2 | R6.2 55.94,86.73 55.13,85.92 R3.2 | U$7.4 C45.1 | C48.+ 20.91,33.83 21.08,33.66
  Top 0.561: U1.4 48.97,88.09
  Top 0.61: v47.65,87.83 C10.1 | R8.2 v41.81,87.83 41.81,85.72 | 41.81,85.72 41.81,84.09 R10.2 | R11.2 41.96,85.88 41.81,85.72 | JP2.3 12.7,12.57 | C19.1 34.37,76.09 | C20.1 v18.89,72.9 | R15.2 v18.89,72.9 | JP1.1 | T1.E 60.59,8.01 | C6.1 21.08,36.2 21.08,33.66 21.08,32.51 19.9,31.33 R36.1 19.9,28.18 19.02,27.3 v12.7,27.3 | C22.+ v18.89,72.9 | v58.47,87.83 R6.2
  Top 0.813: JP2.3 v12.7,7.37 16.79,3.28 58.14,3.28 60.59,5.72 60.59,8.01 C35.1 | C21.+ 37.21,76.07 | L1.1 v39.67,76.09 | C35.1 C34.1 C33.1 | v58.93,19.97 C35.1 | v64.62,46.01 64.62,75.08 58.47,81.23 | JP1.1 58.47,81.23 | 58.47,81.23 v58.47,87.83 C43.+
  Bottom 0.61: v64.62,46.01 R29.2
  Bottom 0.813: v58.47,87.83 v47.65,87.83 v41.81,87.83 39.67,85.7 v39.67,76.09 25.93,76.09 22.73,72.9 v18.89,72.9 | v58.93,19.97 64.52,19.97 66.24,21.69 66.24,44.39 v64.62,46.01 | v12.7,7.37 v12.7,27.3
_5V
  Top 0.305: C29.1 51.95,46.36 50.3,44.71 C30.+ U$5.9 | IC1.5 50.8,56.97
  Top 0.406: C29.1 51.95,56.53 51.51,56.97 50.8,56.97
  Top 0.61: X2.VBUS C29.1
A_3V
  Top 0.381: U$1.P$8 32.89,80.64 | 32.89,80.64 35.43,80.64 | C16.1 U$1.P$14 30.5,84.55 C15.+ | 35.43,80.64 C17.+ | C18.1 32.89,80.64 | 35.43,80.64 37.24,80.64
  Top 0.61: L1.2 37.24,80.64 37.24,85.32 36.42,86.13 32.09,86.13 C15.+
ADC1_IN2  (via drill 0.6 pad 1.42)
  Top 0.305: v14.99,33.91 14.99,41.07 18.05,44.14 U$2.PA2
  Top 0.61: R31.2 R32.1 | R32.1 C42.1 | R32.1 v47.57,28.07
  Bottom 0.305: v14.99,33.91 14.99,24.82 20.7,19.1 27.28,19.1 36.25,28.07 v47.57,28.07
AGND
  Top 0.381: 20.55,85.14 20.55,84.55 U$1.P$15 22.58,84.55 22.58,85.04 | C18.2 32.78,82.59 U$1.P$11 27.69,82.59 27.69,85.65
  pour Top (isolate 0.305, no thermals): 12.06,104.78 12.06,87.1 15.24,83.92 20.95,83.92 20.95,81.38 37.47,81.38 37.47,104.78
CHARGING
  Top 0.305: U$2.PA10 47.27,53.14 48.31,52.09 R30.1
DB0
  Top 0.305: U$2.PD14 41.89,49.14 44.45,46.58 44.45,26.54 52.25,18.75 53.92,18.75 54.3,18.36 54.3,9.07 50.88,5.64 17.88,5.64 14.28,9.25 14.28,17.93 13.41,18.8 11.3,18.8 10.16,17.65 JP2.2
DB1
  Top 0.305: U$2.PD15 42.26,49.64 45.06,46.84 45.06,26.8 52.5,19.36 54.18,19.36 54.91,18.62 54.91,8.81 51.13,5.03 17.63,5.03 13.66,8.99 13.66,13.28 12.7,14.25 JP2.4
DB2  (via drill 0.6 pad 1.42)
  Top 0.305: JP2.6 15.24,23.77 v17.42,25.96 | U$2.PD0 29.97,62.3 v30.76,63.09
  Bottom 0.305: v17.42,25.96 17.42,23.24 20.95,19.71 27.03,19.71 28.88,21.57 28.88,61.21 v30.76,63.09
DB3  (via drill 0.6 pad 1.42)
  Top 0.305: JP2.8 17.78,21.34 v19.38,22.94 | U$2.PD1 29.47,63.45 30.33,64.31 v32,64.31
  Bottom 0.305: v19.38,22.94 22,20.32 26.77,20.32 28.27,21.82 28.27,62.89 29.69,64.31 v32,64.31
DB4
  Top 0.305: U$2.PE7 26.47,26.62 20.32,20.47 JP2.10
DB5
  Top 0.305: U$2.PE8 26.97,23.82 22.86,19.71 JP2.12
DB6
  Top 0.305: U$2.PE9 27.47,20.99 25.4,18.92 JP2.14
DB7
  Top 0.305: U$2.PE10 27.97,16.54 JP2.16
DB8
  Top 0.305: JP2.13 25.4,12.55 26.39,13.54 28.04,13.54 28.85,14.35 28.85,19.68 28.47,20.07 U$2.PE11
DB9
  Top 0.305: U$2.PE12 28.97,20.54 29.52,19.99 29.52,14.15 27.94,12.57 JP2.15
DB10
  Top 0.305: U$2.PE13 29.47,20.98 31.45,19 31.45,13.54 30.48,12.57 JP2.17
DB11
  Top 0.305: U$2.PE14 29.97,21.34 32.05,19.25 32.05,13.54 33.02,12.57 JP2.19
DB12
  Top 0.305: U$2.PE15 30.47,22.42 31.09,21.79 33.73,21.79 33.98,21.54 33.98,14.15 35.56,12.57 JP2.21
DB13
  Top 0.305: U$2.PD8 36.41,46.14 39.06,43.48 39.06,13.54 38.1,12.57 JP2.23
DB14
  Top 0.305: U$2.PD9 36.77,46.64 39.67,43.74 39.67,13.54 40.64,12.57 JP2.25
DB15
  Top 0.305: U$2.PD10 37.14,47.14 40.28,43.99 40.28,26.24 41.91,24.61 41.91,13.84 43.18,12.57 JP2.27
ENUSB
  Top 0.305: R22.1 52.8,46.35 51.97,45.52 51.97,42.93 50.8,41.76 U$5.8
ENUSB_CPU
  Top 0.305: U$2.PC7 42.98,50.64 46,47.62 46.99,47.62 | R22.2 51.07,47.62 46.99,47.62 | R28.2 47.14,47.47 46.99,47.62
F_CS
  Top 0.305: JP2.31 48.26,12.57
GND  (via drill 0.6 pad 1.42)
  Top 0.305: U$2.VSS3 36.69,55.64 36.69,57.24 C4.2 | U$2.VSS2 20.97,41.09 19.38,41.09 C6.2 | U$2.VSSA 15.55,46.64 15.11,46.18 | 49.8,39.16 50.06,39.42 | 51.33,39.42 51.3,39.39 51.8,38.89 U$5.5 | U$5.2 50.3,39.29 50.16,39.42 | U$6.4 57.44,27.36 57.35,27.28 | 57.35,27.28 U$6.T | U$6.7 57.44,27.2 57.35,27.28 | 55.63,27.28 v55.4,27.96 | U$2.PDR_ON 20.97,60.77 v20.27,61.47 | U$2.VSS1 16.56,51.64 15.54,52.66 C7.2 | U$2.BOOT0 23.47,63.12 21.46,65.13
  Top 0.381: 20.4,80.67 20.4,80.64 U$1.P$21 22.91,80.64 22.91,80.67 | 23.01,80.01 23.01,80 U$1.P$22 20.4,80 20.4,80.09 | 22.89,76.07 22.89,76.09 U$1.P$28 19.91,76.09 19.74,75.92
  Top 0.406: JP5.GND1 v62.74,40.67
  Top 0.991: 57.35,27.28 55.4,27.28 v55.4,27.96
  Top 1.016: 48.23,39.4 50.06,39.42 50.16,39.42 U$5.T 51.33,39.42 v53.19,39.42
  other vias: 10.16,9.53 24.97,33.4 46.96,19.84 33.86,34.9 51.95,59.87 37.62,58.9 19.61,38.33 45.92,80.64 51.69,86.13 53.8,76.07 32.26,79.3 22,74.65 18.82,79.73 48.87,54.06 13.94,43.79 59.92,35.05 62.66,31.52 64.36,23.01 54.28,5.36 18.89,66.22 62.43,90.81 33.86,73.03 12.06,52.22 16.64,36.27
  pour Top (isolate 0.305, rank 2, no thermals): 0,104.78 0,0 67.94,0 67.94,104.78
  pour Bottom (isolate 0.305, no thermals): 0,104.78 0,0 67.94,0 67.94,104.78
I2C1_SCL
  Top 0.305: U$2.PB6 24.47,66.39 23.65,67.21 23.65,73.03 | 23.65,73.03 23.65,78.16 23.11,78.69 U$1.P$24 | R15.1 23.52,72.9 23.65,73.03
I2C1_SDA
  Top 0.305: R14.2 24.5,78.17 23.32,79.34 U$1.P$23
I2S_CK
  Top 0.305: U$2.PB3 25.97,66.76 28.42,69.22 28.42,71.93 27.3,73.05 27.3,76.78 27.92,77.39 U$1.P$3
I2S_EXT_SD
  Top 0.305: U$2.PB4 25.47,77.54 27.27,79.34 U$1.P$6
I2S_SD
  Top 0.305: U$1.P$4 27.7,78.05 26.7,77.04 26.7,72.8 27.81,71.68 27.81,69.72 27.08,68.99 R13.2
I2S_WS  (via drill 0.6 pad 1.42)
  Top 0.305: U$2.PA15 31.97,59.25 v36.2,63.48 | U$1.P$5 27.49,78.69 26.09,77.29 26.09,72.54 26.64,71.98 v26.64,70.89
  Top 0.381: U$1.P$5 30.61,78.69 30.61,80 U$1.P$7
  Bottom 0.305: v36.2,63.48 36.2,66.04 33.78,68.45 27.43,68.45 26.64,69.24 v26.64,70.89
KEY_1
  Top 0.305: U$2.PC2 12.22,48.14 11.43,47.35 11.43,40.97 10.27,39.81 U$11.A
KEY_2
  Top 0.305: U$2.PC3 12.59,47.64 12.04,47.09 12.04,40.72 6.4,35.08 6.4,32.44 4.88,30.92 U$12.A
KEY_3
  Top 0.305: U$2.PA0 17.33,45.14 7.01,34.82 7.01,23.52 6.03,22.54 5.71,22.23 5.52,22.03 U$13.A
LCD_BACKLIGHT
  Top 0.305: R12.2 52.76,19.96 45.67,27.05 45.67,47.09 42.62,50.14 U$2.PC6
LCD_CS  (via drill 0.6 pad 1.42)
  Top 0.305: JP2.29 45.72,12.7 45.59,12.7 44.76,13.54 44.76,23.65 42.06,26.34 v42.06,44.14 | U$2.PD7 26.47,66.4 28.52,68.45 30.45,68.45 v31.62,67.28
  Bottom 0.305: v42.06,44.14 30.38,44.14 29.49,45.03 29.49,60.15 33.17,63.83 33.17,65.73 v31.62,67.28
LCD_RD  (via drill 0.6 pad 1.42)
  Top 0.305: JP2.11 22.86,12.57 24.13,13.84 24.13,19.33 v26.29,21.49 | U$2.PD4 27.94,64.67 27.94,65.33 v28.68,66.06
  Bottom 0.305: v26.29,21.49 27.66,22.86 27.64,62.48 27.64,65.02 v28.68,66.06
LCD_RS
  Top 0.305: 17.78,12.57 JP2.7 17.78,9.45 19.76,7.47 47.37,7.47 49.23,9.32 49.23,20.04 43.23,26.04 43.23,44.7 41.74,46.19 R5.2
LCD_WR  (via drill 0.6 pad 1.42)
  Top 0.305: JP2.9 20.32,12.57 21.59,13.84 21.59,20.09 v24.59,23.09 | U$2.PD5 27.47,66.51 28.25,67.28 v29.9,67.28
  Bottom 0.305: v24.59,23.09 25.96,23.09 27.05,24.18 27.05,66.09 28.25,67.28 v29.9,67.28
LED_A
  Top 0.61: JP2.37 55.88,7.24 T1.C
LIPOL
  Top 0.305: U$5.4 U$5.3 50.8,36.5 50.79,36.51 C32.1 | C36.1 58.44,30.06 U$6.2 U$6.3
  Top 0.495: U$3.3 55.77,36.43 C27.1
  Top 0.61: 50.8,36.5 L3.1 | L3.1 | C36.1 C37.1 | C27.1 PAD1.1 | C37.1 | C37.1 PAD1.1 | PAD1.1 50.8,32.46 | 50.8,32.46 L3.1 | 50.8,32.46 R31.1
LOCK_SWITCH
  Top 0.305: S2.2 6.24,8.14 7.62,9.53 7.62,34.57 17.69,44.64 U$2.PA1
LOUT
  Top 0.381: U$1.P$9 26.86,81.3 25.45,82.7 25.45,89.26 27.23,91.03 32.56,91.03 32.99,91.47 C23.+
MICBIAS
  Top 0.381: U$1.P$17 22.95,83.25 23.27,83.57 23.27,85.52 22.06,86.73 R26.2
MICIN
  Top 0.381: U$1.P$18 23.26,82.59 23.95,83.29 23.95,85.8 23.06,86.69 23.06,89.71 22.12,90.65 C25.2 22.1,90.65
N$1
  Top 0.406: 55.96,58.02 X2.D+
  Top 0.599: IC1.3 55.96,58.02
N$2
  Top 0.406: 55.96,56.12 X2.D-
  Top 0.599: IC1.1 55.96,56.12
N$3
  Top 0.305: JP2.20 33.02,20.56 R4.1
N$4
  Top 0.305: U$2.PD11 38.7,47.64 40.04,46.29 R5.1
N$5
  Top 0.305: R1.2 50.93,83.8 | R1.2 50.94,83.78 | U$2.PC10 31.47,60.4 51.89,80.82 51.89,83.06 50.94,84.01 R1.2
N$6
  Top 0.305: U$2.VCAP1 31.97,37.25 C3.1
N$7
  Top 0.305: U$2.VCAP2 37.22,55.14 C4.1
N$8
  Top 0.305: U$2.PC11 30.97,60.76 50.94,80.73 R2.2
N$9  (via drill 0.6)
  other vias: 64.69,102.23
N$10  (via drill 0.6)
  other vias: 3.89,102.23
N$11
  Top 0.305: 57.16,19.45 57.16,7 58.05,6.11 T1.B
  Top 0.406: 57.16,19.45 R12.1
N$12
  Top 0.381: U$1.P$16 19.68,83.89 | 19.68,83.89 C14.+ | C13.1 19.68,84.26 19.68,83.89 | C14.+
N$13
  Top 0.381: R17.2 23.5,94.58
  Top 0.813: J1.TIP 23.5,94.58 26.7,94.58 C23.-
N$14
  Top 0.305: U$2.PB5 24.97,66.75 24.62,67.1 R13.1
N$15
  Top 0.381: R18.2 23.5,98.58
  Top 0.813: J1.RING1 23.5,98.58 26.7,98.58 C24.-
N$16
  Top 0.305: U$2.PB7 23.97,66.03 22.8,67.19 22.8,69.22 | R14.1 22.8,69.22 | R16.1 22.8,69.21 22.8,69.22
N$17
  Top 0.495: U$3.5 R19.1
N$18
  Top 0.305: R20.2 65.98,29.02 65.61,29.39 65.61,32.46 65.18,32.89 63.63,32.89 62.64,33.88 57.56,33.88 56.97,34.47 56.97,39.73 56.73,39.96 U$3.1 55.77,41.95 55.78,41.96 55.35,42.39 53.59,42.39 53.19,42.8 53.19,45.01 55.5,47.32 55.5,49.71 54.81,50.39 53.26,50.39 52.8,50.86 R30.2
N$19
  Top 0.406: R20.1 LED1.C
N$20
  Top 0.406: JP5.VBUS1 63.39,38.07 F3.2
N$21
  Top 0.305: U$5.6 51.8,41.03 51.99,41.22 R21.2
N$22
  Top 0.305: U$5.10 49.8,41.06 49.63,41.22 C31.1
N$23
  Top 0.305: U$6.6 C38.1
N$24
  Top 0.305: U$5.1 49.8,36.97 47.85,35.02 L3.2
N$25
  Top 0.305: U$6.8 57.94,24.77 | 57.94,24.77 57.94,23.57 R24.2 57.83,23.28 R27.1 | C39.1 57.84,24.66 57.94,24.77
N$26
  Top 0.305: U$6.10 61.72,25.98 L2.2
N$27
  Top 0.305: U$6.1 61.72,28.58 L2.1
N$28
  Top 0.305: 19.79,45.64 U$2.VDDA C40.1 | 18.29,40.01 18.29,41.96 19.79,43.46 19.79,45.64 | 18.29,40.01 18.29,36.85 18.79,36.36 R33.2 | U$2.VREF+ 19.79,46.14 19.79,45.64 | C47.1 18.14,40.16 18.29,40.01
N$30
  Top 0.305: U$2.VBAT 17.15,53.64 15.79,55 C44.1
N$31  (via drill 0.6)
  other vias: 3.89,16.51
N$32  (via drill 0.6)
  other vias: 64.69,16.51
N$55
  Top 0.381: C26.2 18.5,91.99 15.24,95.25 15.24,98.42 18.39,101.58 J1.RING2
  Top 0.61: C25.1 20.39,90.69 | C25.1 R26.1 R25.2 | C25.1 C26.2
NRST  (via drill 0.6 pad 1.27, 0.6 pad 1.42)
  Top 0.305: U$2.NRST v16.51,49.64 15.24,49.64 15.09,49.79 R35.1 14.97,49.79 13.88,48.7 5.71,48.7 | U$14.A 5.71,48.7 | C46.1 5.82,48.6 5.71,48.7
  Top 0.406: JP1.5 v50.16,71.07
  Bottom 0.305: v50.16,71.07 29.39,71.07 28.4,72.06 26.16,72.06 25.48,71.37 25.48,52.15 22.97,49.64 v16.51,49.64
OSC32_IN
  Top 0.305: U$2.PC14 17.29,52.64 15.85,54.08 10.82,54.08 9.88,55.02 X1.1
  Top 0.61: C1.2 X1.1
OSC32_OUT
  Top 0.305: U$2.PC15 16.92,52.14 15.6,53.47 10.82,53.47 9.88,52.52 X1.2
  Top 0.61: C2.2 X1.2
PH0
  Top 0.305: U$2.PH0 14.09,50.64 12.97,49.52 U$7.3
PWR_BTN  (via drill 0.6 pad 1.42)
  Top 0.305: U$2.PB10 30.97,26.49 v33.71,23.75
  Top 0.406: U$8.A v62.23,10.99
  Bottom 0.305: v62.23,10.99 46.47,10.99 v33.71,23.75
REST
  Top 0.305: U$2.PD13 41.53,48.64 43.84,46.33 43.84,26.29 51.77,18.36 51.77,13.54 50.8,12.57 JP2.33
ROUT
  Top 0.381: U$1.P$10 27.3,81.94 26.92,82.32 26.92,88.52 27.94,89.53 34.29,89.53 35.56,90.81 35.56,96.32 32.99,98.88 C24.+
SD_CLK
  Top 0.305: U$2.PA5 22.47,24.35 18.75,20.62 18.75,9.35 20.02,8.08 46.05,8.08 47.3,9.32 47.3,13.28 48.26,14.25 JP2.32
SD_CS
  Top 0.305: U$2.PA4 21.97,29.84 | 21.97,29.84 21.97,28.82 16.2,23.06 16.2,9.3 19.25,6.25 49.25,6.25 52.07,9.07 52.07,12.95 53.34,14.22 JP2.36 | R36.2 21.66,30.15 21.97,29.84
SD_DIN  (via drill 0.6 pad 1.42)
  Top 0.305: 50.8,17.65 JP2.34 50.8,14.25 49.84,13.28 49.84,9.07 47.62,6.86 19.51,6.86 16.82,9.55 16.82,22.02 v20.75,25.96 | U$2.PA7 23.47,26.62 v24.13,25.96
  Bottom 0.305: v24.13,25.96 v20.75,25.96
SD_DO
  Top 0.305: U$2.PA6 22.97,23.98 19.36,20.37 19.36,9.6 20.27,8.69 45.8,8.69 46.69,9.58 46.69,13.28 45.72,14.25 JP2.30
SDIO_CD
  Top 0.305: 54.84,90.38 U1.CD1 54.71,91.85 53.67,92.89 44.6,92.89 43.59,91.87 43.59,89.38 43.2,89 41.33,89 40.3,87.98 R10.1 40.3,82.89 42.72,80.47 42.72,75.11 33.71,66.09 30.38,66.09 28.47,64.18 U$2.PD3
SDIO_CLK
  Top 0.305: U1.5 50.09,90.43 50.09,85.72 | U$2.PC12 30.47,61.12 50.09,80.75 50.09,85.72 | R9.1 50.08,85.73 50.09,85.72
SDIO_CMD
  Top 0.305: U1.3 47.87,91.65 47.24,92.28 44.86,92.28 44.21,91.63 44.21,86.4 43.7,85.89 R11.1 | R11.1 44.05,85.88 | U$2.PD2 28.97,63.82 30.63,65.48 33.96,65.48 43.35,74.88 43.35,85.88 R11.1
SDIO_D0  (via drill 0.6 pad 1.42)
  Top 0.305: U$2.PC8 44.14,51.14 v46.48,48.79 | U1.7 52.27,88.85 53.06,88.06 53.06,85.72 | R3.1 53.21,85.88 53.06,85.72 | 53.06,85.72 53.06,81.13 37.36,65.43 v37.36,62.2
  Bottom 0.305: v46.48,48.79 33.38,48.79 32,50.16 32,56.84 v37.36,62.2
SDIO_D1  (via drill 0.6 pad 1.42)
  Top 0.305: U$2.PC9 45.39,51.64 v46.48,50.55 | U1.8 53.37,88.74 54.24,87.87 R6.1 54.28,87.8 54.28,85.01 53.67,84.4 53.67,80.87 38.53,65.73 v38.53,63.48
  Bottom 0.305: v46.48,50.55 45.34,49.4 33.63,49.4 32.61,50.42 32.61,56.59 37.06,61.04 37.85,61.04 38.53,61.72 v38.53,63.48
SDIO_D2
  Top 0.305: 46.3,85.72 46.3,84.86 47.12,84.05 R1.1 | 46.3,85.72 46.3,88.65 45.67,89.28 U1.1 | R7.1 46.34,85.76 46.3,85.72
SDIO_D3
  Top 0.305: U1.2 46.77,91.46 46.56,91.67 45.11,91.67 44.83,91.39 44.83,87.83 R8.1 45.06,85.12 48.08,82.09 R2.1
SW2
  Top 0.305: U$2.PB9 22.47,62.4 20.95,63.91 U$4.SW2
SW_A
  Top 0.305: U$4.A 16.53,58.66 17.14,58.04 17.14,56.06 17.56,55.64 U$2.PE3
SW_B
  Top 0.305: U$2.PB8 22.97,62.76 21.21,64.52 17.91,64.52 16.74,65.68 16.74,67.13 16.46,67.41 U$4.B
SWD_CLK
  Top 0.305: U$2.PA14 32.47,58.86 34.65,61.04 37.85,61.04 39.73,62.92 39.73,64.8 53.62,78.69 JP1.2
SWD_IO
  Top 0.305: U$2.PA13 38.56,54.64 40.34,56.41 40.34,64.54 49.4,73.61 JP1.4
T_CLK
  Top 0.305: U$2.PB13 35.32,44.64 36.27,43.69 36.27,20.24 34.59,18.57 34.59,14.4 35.46,13.54 36.45,13.54 36.83,13.16 36.83,9.86 36.27,9.3 29.79,9.3 29.21,9.88 29.21,12.98 30.48,14.25 JP2.18
T_CS
  Top 0.305: R4.2 34.84,20.74 35.66,21.57 35.66,39.62 34.56,40.72 R37.2 | R37.2 34.56,40.73 | U$2.PB12 34.22,41.12 R37.2
T_DIN
  Top 0.305: U$2.PB15 36.05,45.64 38.46,43.23 38.46,21.57 35.56,18.67 JP2.22
T_DO  (via drill 0.6 pad 1.27)
  Top 0.305: JP2.26 v40.64,24.31 | U$2.PB14 35.68,45.14 37.36,43.46 v37.36,24.31
  Bottom 0.305: v37.36,24.31 v40.64,24.31
T_IRQ
  Top 0.305: U$2.PD12 40.2,48.14 40.89,47.45 40.89,26.49 43.18,24.21 JP2.28
UART1_TX  (via drill 0.6 pad 1.42)
  Top 0.305: U$2.PA9 46.9,52.64 48.9,50.65 v50.01,50.65 | JP1.6 60.38,68.53 62.23,66.67 62.23,55.24 60.12,53.14 55.45,53.14 v54.41,52.09
  Bottom 0.406: v54.41,52.09 51.46,52.09 v50.01,50.65
USB_D_N
  Top 0.254: IC1.6 49.58,56.12 48.88,56.81 43.62,56.81 40.45,53.64 U$2.PA11
USB_D_P
  Top 0.254: IC1.4 49.58,58.02 48.88,57.31 43.48,57.31 40.3,54.14 U$2.PA12
USBFAULT  (via drill 0.6 pad 1.42)
  Top 0.305: U$5.7 51.3,41.39 52.58,42.67 52.58,45.26 54.33,47.02 v54.33,49.23
  Top 0.61: R23.1 v54.33,49.23
  Bottom 0.61: R29.1 v54.33,49.23
USBFAULT_CPU
  Top 0.305: U$2.PA8 46.54,52.14 49.45,49.23 R23.2
VBUS
  Top 0.406: U$3.4 58.18,38.08 F3.1 59.95,36.74 60.43,36.27 62.94,36.27 63.4,35.81 63.4,34.21 64.05,33.57 LED1.A
  Top 0.495: U$3.4 C28.1
VOL_DN
  Top 0.305: U$10.A 3.5,81.72 4.32,80.9 4.32,73.97 6.12,72.16 10.24,72.16 11.46,70.94 11.46,61.04 13.06,59.44 16.61,59.44 17.75,58.29 17.75,56.44 18.05,56.14 U$2.PE2
VOL_UP
  Top 0.305: U$2.PE0 21.97,62.03 20.88,63.12 13.08,63.12 12.06,64.14 12.06,71.2 10.49,72.77 6.38,72.77 4.93,74.22 4.93,91.59 3.37,93.15 U$9.A
XTI
  Top 0.305: U$1.P$25 14.09,78.05 | 14.09,78.05 13.34,78.05 12.7,78.68 C11.1 | Y2.3 14.09,78.05
XTO
  Top 0.305: U$1.P$26 16.39,77.39 | 16.39,77.39 13.34,77.39 12.7,76.76 C12.1 | Y2.1 16.39,77.39

### Text on the board
Top: SQ9RZI